# Altium schematic sheet DCmeter.SchDoc
size A3; SheetNumber: 1; SheetTotal: 1
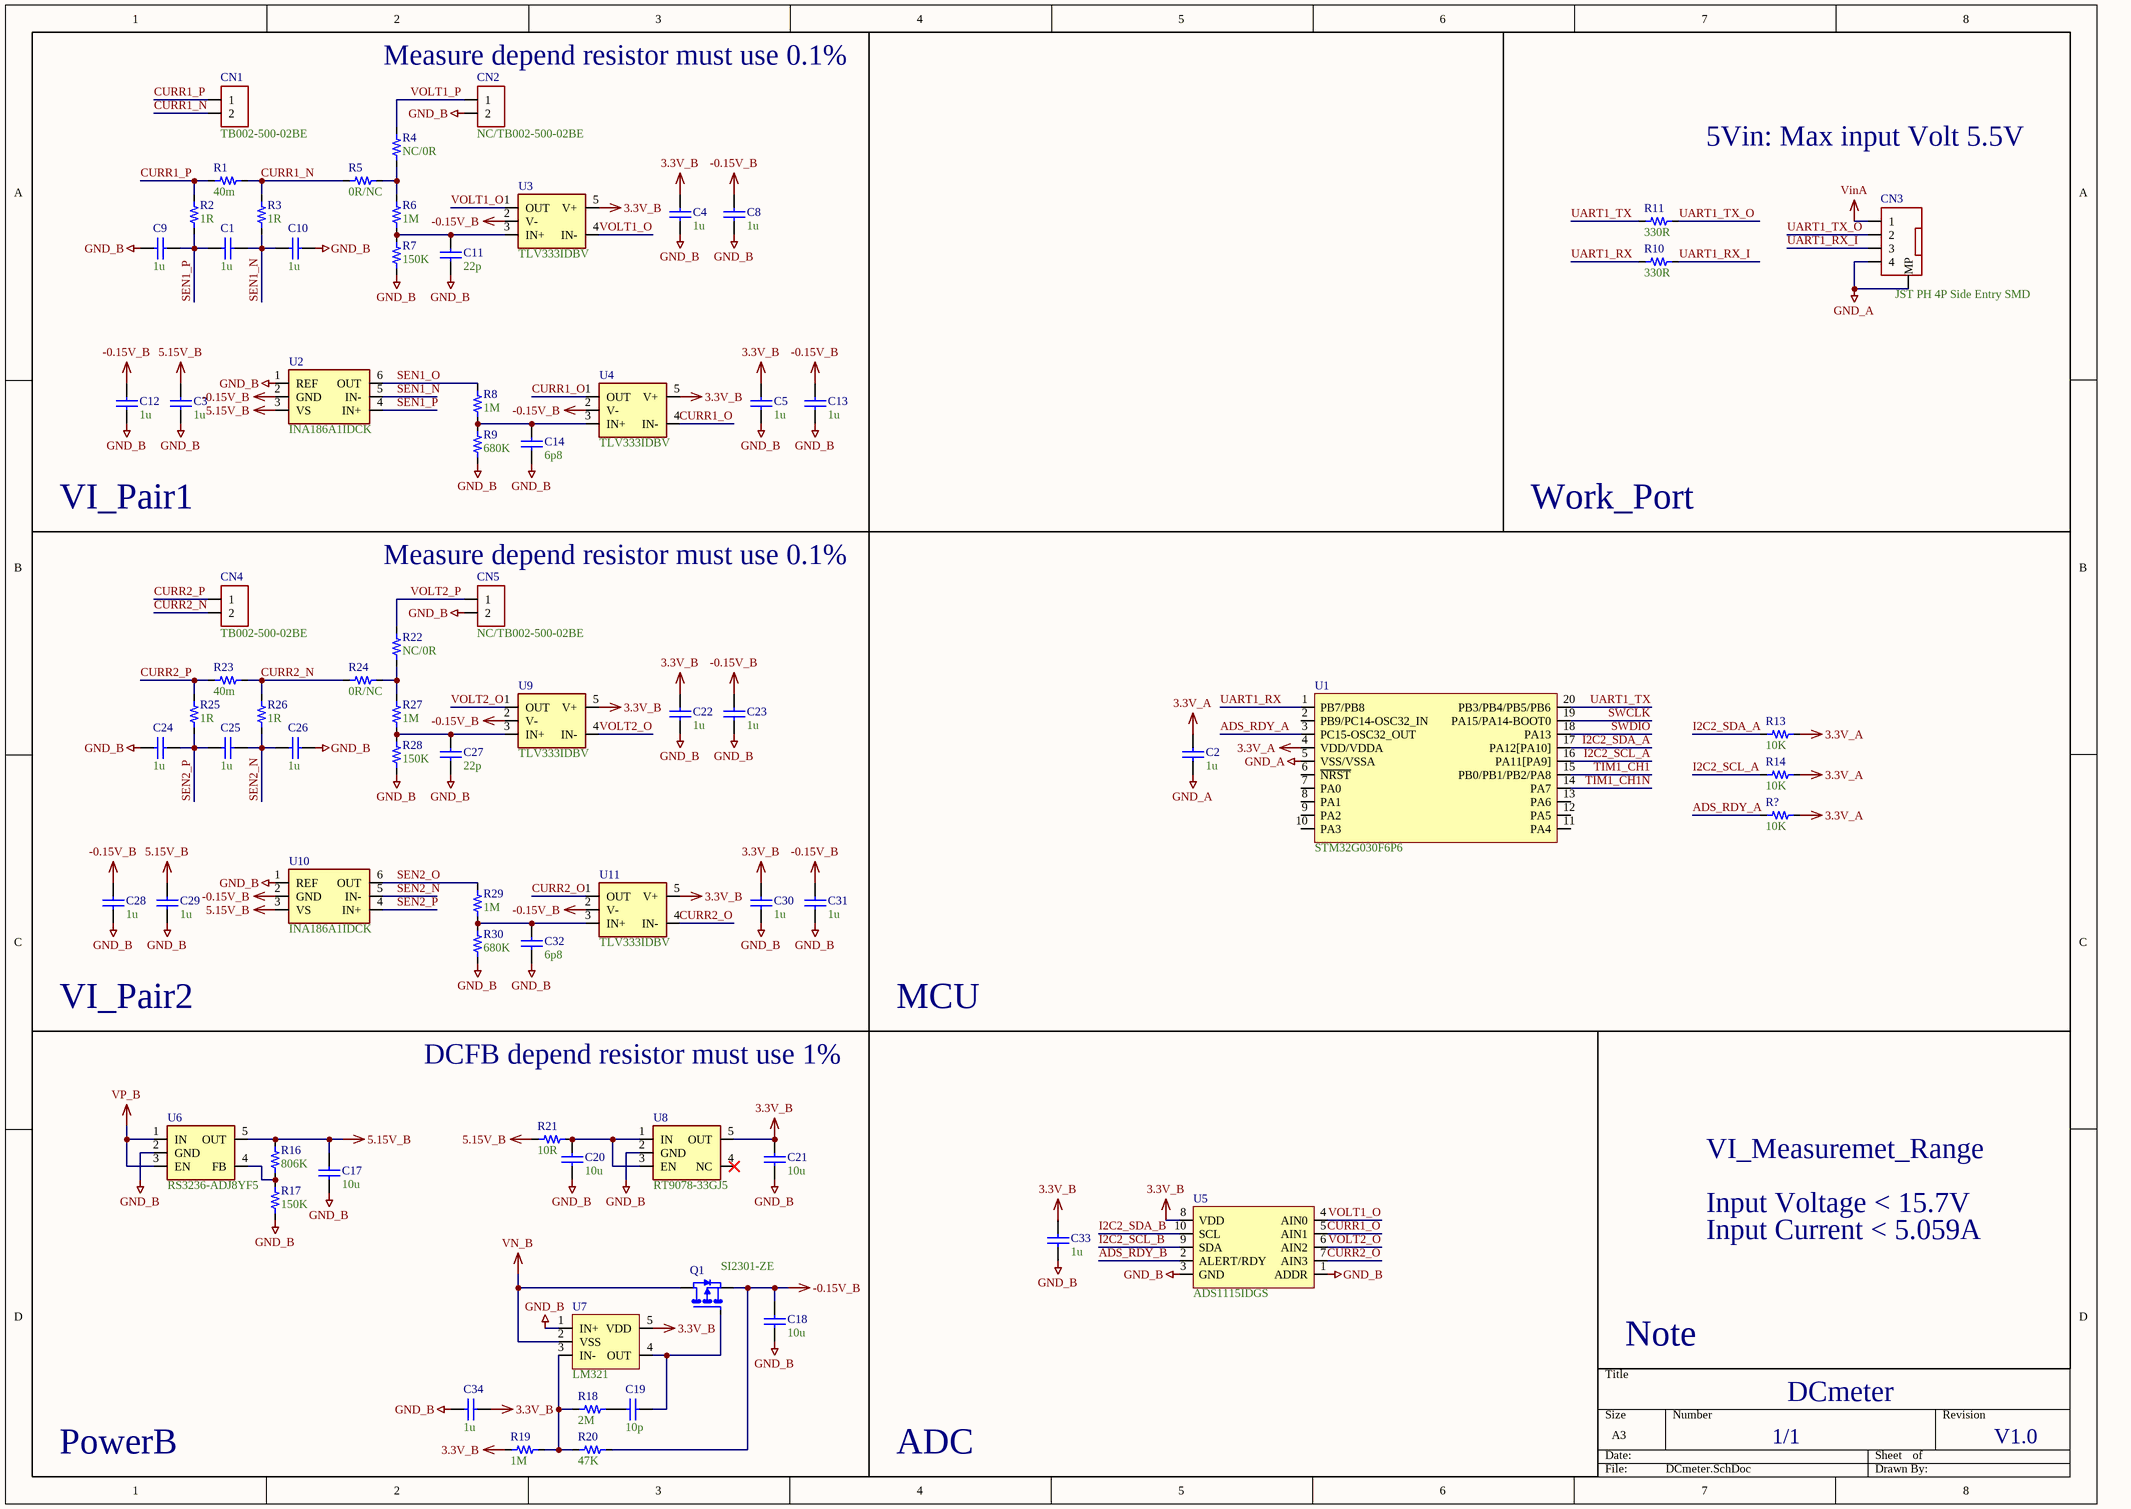
[diagram p0: DCmeter.SchDoc]

## Parts
C1  1u  [CAP_0603]
C2  1u  [CAP_0402]
C3  1u  [CAP_0402]
C4  1u  [CAP_0402]
C5  1u  [CAP_0402]
C8  1u  [CAP_0402]
C9  1u  [CAP_0603]
C10  1u  [CAP_0603]
C11  22p  [CAP_0402]
C12  1u  [CAP_0402]
C13  1u  [CAP_0402]
C14  6p8  [CAP_0402]
C17  10u  [CAP_0603]
C18  10u  [CAP_0402]
C19  10p  [CAP_0402]
C20  10u  [CAP_0603]
C21  10u  [CAP_0603]
C22  1u  [CAP_0402]
C23  1u  [CAP_0402]
C24  1u  [CAP_0603]
C25  1u  [CAP_0603]
C26  1u  [CAP_0603]
C27  22p  [CAP_0402]
C28  1u  [CAP_0402]
C29  1u  [CAP_0402]
C30  1u  [CAP_0402]
C31  1u  [CAP_0402]
C32  6p8  [CAP_0402]
C33  1u  [CAP_0402]
C34  1u  [CAP_0402]
CN1  TB002-500-02BE  [TB002-500-02BE]
CN2  NC/TB002-500-02BE  [TB002-500-02BE]
CN3  JST PH 4P Side Entry SMD  [S4B_PH_SM4_TB]
CN4  TB002-500-02BE  [TB002-500-02BE]
CN5  NC/TB002-500-02BE  [TB002-500-02BE]
Q1  SI2301-ZE  [SOT-23-3_290X130X103_95P]
R1  40m  [RES_1206]
R2  1R  [RES_0603]
R3  1R  [RES_0603]
R4  NC/0R  [RES_0603]
R5  0R/NC  [RES_0603]
R6  1M  [RES_0603]
R7  150K  [RES_0603]
R8  1M  [RES_0603]
R9  680K  [RES_0603]
R10  330R  [RES_0402]
R11  330R  [RES_0402]
R13  10K  [RES_0402]
R14  10K  [RES_0402]
R16  806K  [RES_0402]
R17  150K  [RES_0402]
R18  2M  [RES_0402]
R19  1M  [RES_0402]
R20  47K  [RES_0402]
R21  10R  [RES_0402]
R22  NC/0R  [RES_0603]
R23  40m  [RES_1206]
R24  0R/NC  [RES_0603]
R25  1R  [RES_0603]
R26  1R  [RES_0603]
R27  1M  [RES_0603]
R28  150K  [RES_0603]
R29  1M  [RES_0603]
R30  680K  [RES_0603]
R?  10K  [RES_0402]
U1  STM32G030F6P6  [TSSOP-20_650x440x110_65P]
U2  INA186A1IDCK  [SOT-363-6_215X130X110_65P]
U3  TLV333IDBV  [SOT-23-5_290X160X120_95P]
U4  TLV333IDBV  [SOT-23-5_290X160X120_95P]
U5  ADS1115IDGS  [MSOP-10_300x300x110_50P]
U6  RS3236-ADJ8YF5  [SOT-23-5_290X160X120_95P]
U7  LM321  [SOT-23-5_290X160X120_95P]
U8  RT9078-33GJ5  [SOT-23-5_290X160X120_95P]
U9  TLV333IDBV  [SOT-23-5_290X160X120_95P]
U10  INA186A1IDCK  [SOT-363-6_215X130X110_65P]
U11  TLV333IDBV  [SOT-23-5_290X160X120_95P]

## Blocks framed on the sheet
VI_Pair1: C1 C3-C5 C8-C14 CN1 CN2 R1-R9 U2-U4
Work_Port: CN3 R10 R11
VI_Pair2: C22-C32 CN4 CN5 R22-R30 U9-U11
MCU: C2 R13 R14 R? U1

## Nets
3.3V_A: C2.1 R13.2 R14.2 R?.2 U1.4(VDD/VDDA)
3.3V_B: C4.1 C5.1 C21.1 C22.1 C30.1 C33.1 C34.1 R19.2 U3.5(V+) U4.5(V+) U5.8(VDD) U7.5(VDD) U8.5(OUT) U9.5(V+) U11.5(V+)
5.15V_B: C3.1 C17.1 C29.1 R16.2 R21.2 U2.3(VS) U6.5(OUT) U10.3(VS)
-0.15V_B: C8.1 C12.1 C13.1 C18.1 C23.1 C28.1 C31.1 Q1.2(S) R20.1 U2.2(GND) U3.2(V-) U4.2(V-) U9.2(V-) U10.2(GND) U11.2(V-)
GND_A: C2.2 CN3.0(MP) CN3.4 U1.5(VSS/VSSA)
GND_B: C3.2 C4.2 C5.2 C8.2 C9.2 C10.2 C11.2 C12.2 C13.2 C14.2 C17.2 C18.2 C20.2 C21.2 C22.2 C23.2 C24.2 C26.2 C27.2 C28.2 C29.2 C30.2 C31.2 C32.2 C33.2 C34.2 CN2.2 CN5.2 R7.1 R9.1 R17.1 R28.1 R30.1 U2.1(REF) U5.1(ADDR) U5.3(GND) U6.2(GND) U7.1(IN+) U8.2(GND) U10.1(REF)
VinA: CN3.1
VN_B: Q1.3(D) U7.2(VSS)
VP_B: U6.1(IN) U6.3(EN)
ADS_RDY_A: R?.1 U1.3(PC15-OSC32_OUT)
ADS_RDY_B: U5.2(ALERT/RDY)
CURR1_N: CN1.2 R1.1 R3.2 R5.2
CURR1_O: U4.1(OUT) U4.4(IN-) U5.5(AIN1)
CURR1_P: CN1.1 R1.2 R2.2
CURR2_N: CN4.2 R23.1 R24.2 R26.2
CURR2_O: U5.7(AIN3) U11.1(OUT) U11.4(IN-)
CURR2_P: CN4.1 R23.2 R25.2
I2C2_SCL_A: R14.1 U1.16(PA11[PA9])
I2C2_SCL_B: U5.9(SDA)
I2C2_SDA_A: R13.1 U1.17(PA12[PA10])
I2C2_SDA_B: U5.10(SCL)
SEN1_N: C1.2 C10.1 R3.1 U2.5(IN-)
SEN1_O: R8.2 U2.6(OUT)
SEN1_P: C1.1 C9.1 R2.1 U2.4(IN+)
SEN2_N: C25.2 C26.1 R26.1 U10.5(IN-)
SEN2_O: R29.2 U10.6(OUT)
SEN2_P: C24.1 C25.1 R25.1 U10.4(IN+)
SWCLK: U1.19(PA15/PA14-BOOT0)
SWDIO: U1.18(PA13)
TIM1_CH1: U1.15(PB0/PB1/PB2/PA8)
TIM1_CH1N: U1.14(PA7)
UART1_RX: R10.2 U1.1(PB7/PB8)
UART1_RX_I: CN3.3 R10.1
UART1_TX: R11.2 U1.20(PB3/PB4/PB5/PB6)
UART1_TX_O: CN3.2 R11.1
VOLT1_O: U3.1(OUT) U3.4(IN-) U5.4(AIN0)
VOLT1_P: CN2.1 R4.2
VOLT2_O: U5.6(AIN2) U9.1(OUT) U9.4(IN-)
VOLT2_P: CN5.1 R22.2
NetC11_1: C11.1 R6.1 R7.2 U3.3(IN+)
NetC14_1: C14.1 R8.1 R9.2 U4.3(IN+)
NetC19_1: C19.1 R18.1
NetC19_2: C19.2 Q1.1(G) U7.4(OUT)
NetC20_1: C20.1 R21.1 U8.1(IN) U8.3(EN)
NetC27_1: C27.1 R27.1 R28.2 U9.3(IN+)
NetC32_1: C32.1 R29.1 R30.2 U11.3(IN+)
NetR4_1: R4.1 R5.1 R6.2
NetR16_1: R16.1 R17.2 U6.4(FB)
NetR18_2: R18.2 R19.1 R20.2 U7.3(IN-)
NetR22_1: R22.1 R24.1 R27.2

Not connected (* = marked no-connect by the designer): U1 2(PB9/PC14-OSC32_IN) 6(~{NRST}) 7(PA0) 8(PA1) 9(PA2) 10(PA3) 11(PA4) 12(PA5) 13(PA6); U8 4(NC)*

## Notes on the sheet
- (near CN2) Measure depend resistor must use 0.1%
- 5Vin: Max input Volt 5.5V
- (near CN5) Measure depend resistor must use 0.1%
- DCFB depend resistor must use 1%
- VI_Measuremet_Range
- Input Voltage < 15.7V
- Input Current < 5.059A
- Note
- PowerB
- ADC
- DCmeter
- 1/1
- V1.0

## Library data of the parts
C1-C5 C8-C14 C17-C34 = Capacitor: Voltage: V
  C1-C5 C8-C10 C12 C13 C22-C26 C28-C31 C33 C34: Value: 1u
  C11 C27: Value: 22p
  C14 C32: Value: 6p8
  C17 C18 C20 C21: Value: 10u
  C19: Value: 10p
CN1 CN2 CN4 CN5 = TB002-500-02BE: screw Terminal Block Connector Pitch 5.0mm 2 poles, CUI Devices_TB002-500-02BE
  CN1 CN4: Value: TB002-500-02BE
  CN2 CN5: Value: NC/TB002-500-02BE
CN3 = S4B-PH-SM4-TB: JST PH 2.0mm 4P SMD / S4B-PH-SM4-TB; Value: JST PH 4P Side Entry SMD
Q1 = SI2301-ZE: P-MOSFET; Value: SI2301-ZE
R1-R11 R13 R14 R16-R30 R? = Resistor: Voltage: V
  R1 R23: Value: 40m
  R2 R3 R25 R26: Value: 1R
  R4 R22: Value: NC/0R
  R5 R24: Value: 0R/NC
  R6 R8 R19 R27 R29: Value: 1M
  R7 R17 R28: Value: 150K
  R9 R30: Value: 680K
  R10 R11: Value: 330R
  R13 R14 R?: Value: 10K
  R16: Value: 806K
  R18: Value: 2M
  R20: Value: 47K
  R21: Value: 10R
U1 = STM32G030F6P6: MCU Cortex-M0+; Value: STM32G030F6P6
U2 U10 = INA186A1IDCK: Current Sense Amplifier gain 25 vos 50uV; Value: INA186A1IDCK
U3 U4 U9 U11 = TLV333IDBV: Single precision OPA; Value: TLV333IDBV
U5 = ADS1115IDGS: Ultra-Small, Low-Power, I2C-Compatible, 860-SPS, 16-Bit ADCs; Value: ADS1115IDGS
U6 = RS3236-ADJ8YF5: LDO Adjustable; Value: RS3236-ADJ8YF5
U7 = LM321: Single_OPA; Value: LM321
U8 = RT9078-33GJ5: LDO 3.3V; Value: RT9078-33GJ5